# Altium project projectmotherboad1.PrjPcb
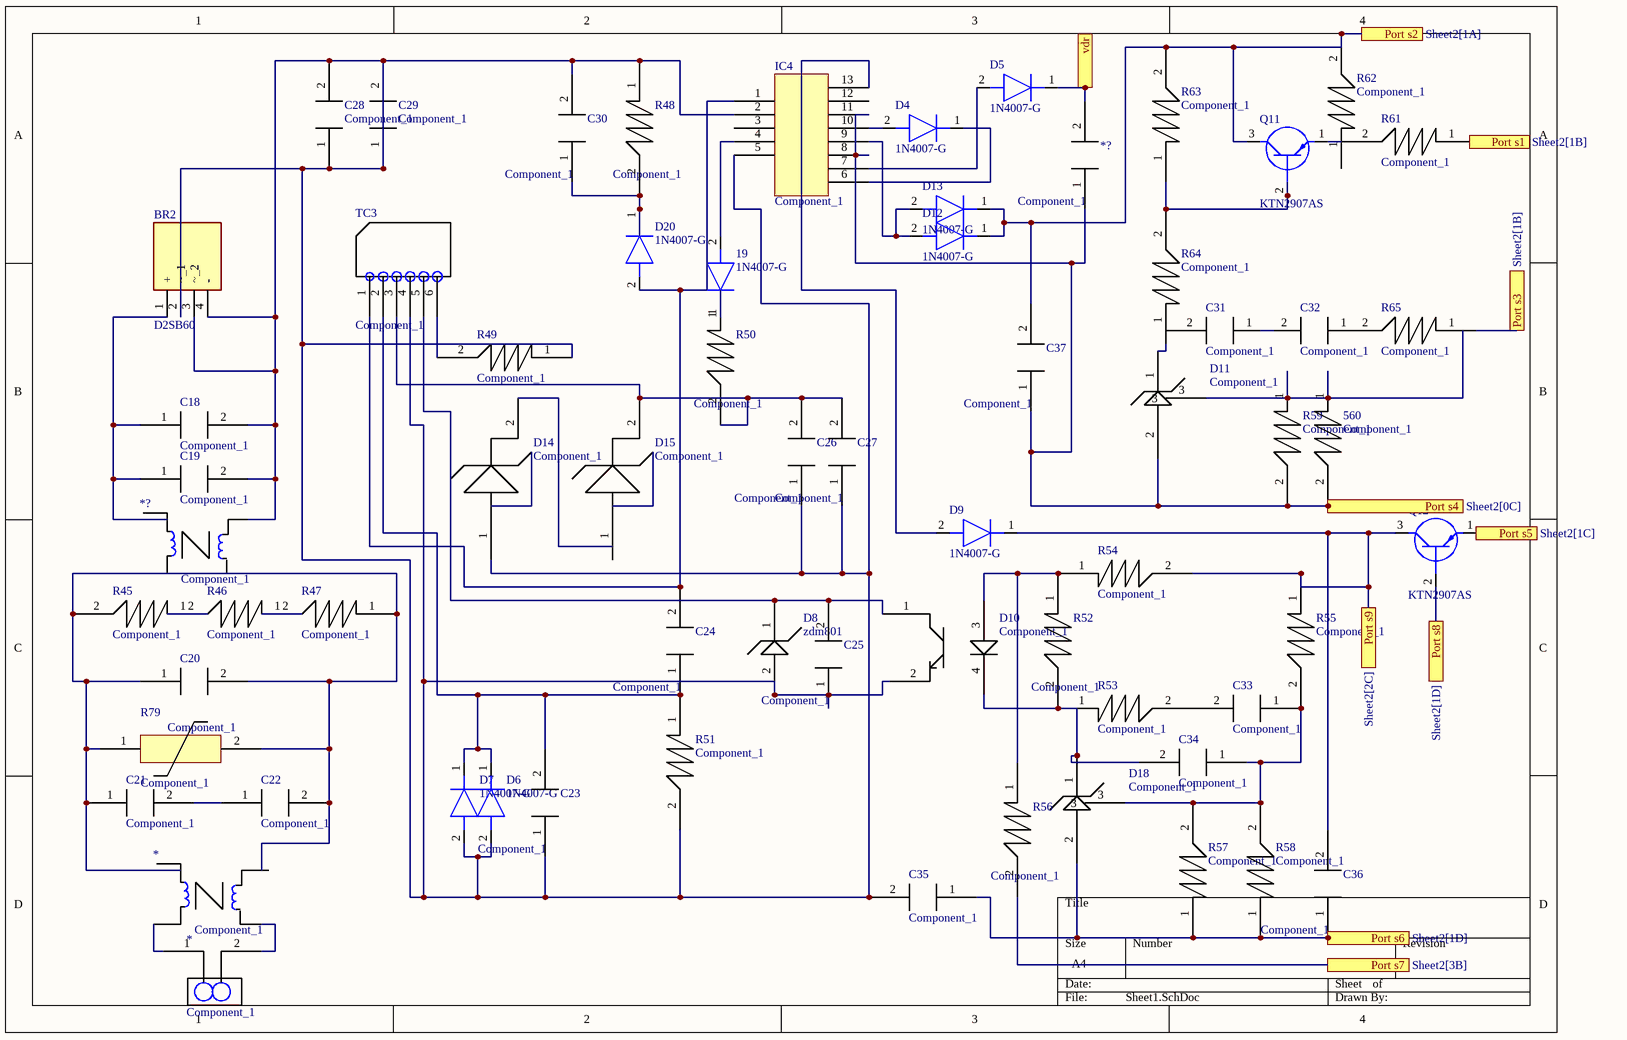
[diagram p0: Sheet1.SchDoc]
2 sheets, 92 parts. Net scope: flat (ports and power ports of the same name join across sheets).
Sheets:
  Sheet1.SchDoc
  Sheet2.SchDoc

## Sheet Sheet1.SchDoc
size A4; SheetNumber: 1; SheetTotal: 2

### Parts
(Parts that share a designator on the sheet are numbered #1, #2 ... from top to bottom, then left to right.)
19  1N4007-G  [DIOAD1410W90L470D235]
560  Component_1  [PCBComponent_1]
*#1  Component_1  [PCBComponent_1]
*#2  Component_1  [PCBComponent_1]
*?#1  Component_1  [PCBComponent_1]
*?#2  Component_1  [PCBComponent_1]
BR2  D2SB60  [D2SB60]
C18  Component_1  [PCBComponent_1]
C19  Component_1  [PCBComponent_1]
C20  Component_1  [PCBComponent_1]
C21  Component_1  [PCBComponent_1]
C22  Component_1  [PCBComponent_1]
C23  Component_1  [PCBComponent_1]
C24  Component_1  [PCBComponent_1]
C25  Component_1  [PCBComponent_1]
C26  Component_1  [PCBComponent_1]
C27  Component_1  [PCBComponent_1]
C28  Component_1  [PCBComponent_1]
C29  Component_1  [PCBComponent_1]
C30  Component_1  [PCBComponent_1]
C31  Component_1  [PCBComponent_1]
C32  Component_1  [PCBComponent_1]
C33  Component_1  [PCBComponent_1]
C34  Component_1  [PCBComponent_1]
C35  Component_1  [PCBComponent_1]
C36  Component_1  [PCBComponent_1]
C37  Component_1  [PCBComponent_1]
D4  1N4007-G  [DIOAD1410W90L470D235]
D5  1N4007-G  [DIOAD1410W90L470D235]
D6  1N4007-G  [DIOAD1410W90L470D235]
D7  1N4007-G  [DIOAD1410W90L470D235]
D8  zdm801  [PCBComponent_1]
D9  1N4007-G  [DIOAD1410W90L470D235]
D10  Component_1  [PCBComponent_1]
D11  Component_1  [PCBComponent_1]
D12  1N4007-G  [DIOAD1410W90L470D235]
D13  1N4007-G  [DIOAD1410W90L470D235]
D14  Component_1
D15  Component_1
D18#1  Component_1  [PCBComponent_1]
D20  1N4007-G  [DIOAD1410W90L470D235]
IC4  Component_1  [PCBComponent_1]
Q11  KTN2907AS  [SOT95P245X130-3N]
Q12  KTN2907AS  [SOT95P245X130-3N]
R45  Component_1  [PCBComponent_1]
R46  Component_1  [PCBComponent_1]
R47  Component_1  [PCBComponent_1]
R48  Component_1  [PCBComponent_1]
R49  Component_1  [PCBComponent_1]
R50  Component_1  [PCBComponent_1]
R51  Component_1  [PCBComponent_1]
R52  Component_1  [PCBComponent_1]
R53  Component_1  [PCBComponent_1]
R54  Component_1  [PCBComponent_1]
R55  Component_1  [PCBComponent_1]
R56  Component_1  [PCBComponent_1]
R57  Component_1  [PCBComponent_1]
R58  Component_1  [PCBComponent_1]
R59  Component_1  [PCBComponent_1]
R61  Component_1  [PCBComponent_1]
R62  Component_1  [PCBComponent_1]
R63  Component_1  [PCBComponent_1]
R64  Component_1  [PCBComponent_1]
R65  Component_1  [PCBComponent_1]
R79  Component_1
TC3  Component_1  [PCBComponent_1]

### Ports
Port s1 (see Sheet2[1B]), Port s2 (see Sheet2[1A]), Port s3 (see Sheet2[1B]), Port s4 (see Sheet2[0C]), Port s5 (see Sheet2[1C]), Port s6 (see Sheet2[1D]), Port s7 (see Sheet2[3B]), Port s8 (see Sheet2[1D]), Port s9 (see Sheet2[2C]), vdr

### Nets
Net19_1: 19.1(K) R50.1
Net19_2: 19.2(A) IC4.4
Net560_1: 560.1 D11.3 R59.1
Net560_2: 560.2 *?#1.1 C35.1 C36.1 C36.2 C37.1 D9.1(K) D11.2 D18#1.2 IC4.8 IC4.11 Q12.3(C) R54.2 R55.1 R57.1 R58.1 R59.2 ; port Port s4, port Port s6, port Port s9
Net*?#1_2: *?#1.2 D5.1(K) ; port vdr
Net*?#3_1: R65.1 ; port Port s3
NetBR2_1: BR2.1(+) C18.1 C19.1
NetBR2_2: BR2.2(~_1) BR2.3(~_2) BR2.4(-) C18.2 C19.2 C23.1 C25.1 C26.1 C27.1 C28.1 C28.2 C29.1 C29.2 C30.2 C35.2 D6.2(A) D7.2(A) D8.2 D10.2 D14.1 IC4.2 IC4.5 R48.1 R49.1 R51.2 TC3.4
NetC20_1: C20.1 C20.2 C21.1 C22.2 R45.2 R47.1 R79.1 R79.2
NetC21_2: C21.2 C22.1
NetC23_2: C23.2 C24.1 D6.1(K) D7.1(K) R51.1 TC3.2
NetC24_2: C24.2 D20.2(A) IC4.1 TC3.1
NetC25_2: C25.2 D8.1 D10.1 TC3.5
NetC26_2: C26.2 C27.2 D15.2 R50.2 TC3.3
NetC30_1: C30.1 D20.1(K) R48.2
NetC31_1: C31.1 C32.2
NetC33_1: C33.1 C34.1 D18#1.3 R55.2 R57.2 R58.2
NetC33_2: C33.2 R53.2
NetC34_2: C34.2 D10.4 D18#1.1 R52.2 R53.1
NetC37_2: C37.2 D12.1(K) D13.1(K) Q11.3(C) R62.2 R63.2 ; port Port s2
NetC40_2: Q12.1(E) ; port Port s5
NetD4_1: D4.1(K) IC4.6
NetD4_2: D4.2(A) IC4.10
NetD5_2: D5.2(A) IC4.7
NetD9_2: D9.2(A) IC4.13
NetD10_3: D10.3 R52.1 R54.1 R56.1
NetD11_1: D11.1 R64.1
NetD12_2: D12.2(A) D13.2(A) IC4.9
NetD18#2_2: Q12.2(B) ; port Port s8
NetQ11_1: Q11.1(E) R61.2
NetQ11_2: Q11.2(B) R63.1 R64.2
NetQ15_1: R56.2 ; port Port s7
NetR45_1: R45.1 R46.2
NetR46_1: R46.1 R47.2
NetR49_2: R49.2 TC3.6

Not connected (* = marked no-connect by the designer): *#1 1 2; C31 2; C32 1; D14 2; D15 1; IC4 3 12; R61 1; R62 1; R65 2

### Library data of the parts
19 D4-D7 D9 D12 D13 D20 = 1N4007-G: Diode; Manufacturer_Name: Comchip Technology; Datasheet Link: https://datasheet.datasheetarchive.com/originals/distributors/Datasheets-DGA23/1390217.pdf; Manufacturer_Part_Number: 1N4007-G; Mouser Part Number: 750-1N4007-G; Mouser Price/Stock: https://www.mouser.co.uk/ProductDetail/Comchip-Technology/1N4007-G?qs=2qJf6qQ4IOKzApuByvlhjQ%3D%3D; Arrow Part Number: 1N4007-G; Arrow Price/Stock: https://www.arrow.com/en/products/1n4007-g/comchip-technology?region=nac
BR2 = D2SB60: Bridge Rectifier; Manufacturer_Name: Taiwan Semiconductor; Datasheet Link: https://www.taiwansemi.com/assets/uploads/datasheet/D2SB05%20SERIES_K2103.pdf; Height: 11.3mm; Manufacturer_Part_Number: D2SB60; Mouser Part Number: 821-D2SB60; Mouser Price/Stock: https://www.mouser.com/Search/Refine.aspx?Keyword=821-D2SB60
Q11 Q12 = KTN2907AS: Transistor BJT PNP; Manufacturer_Name: KEC; Datasheet Link: https://4donline.ihs.com/images/VipMasterIC/IC/KECC/KECC-S-A0011628695/KECC-S-A0011628695-1.pdf?hkey=EF798316E3902B6ED9A73243A3159BB0; Height: 1.3mm; Manufacturer_Part_Number: KTN2907AS

## Sheet Sheet2.SchDoc
size A4; SheetNumber: 2; SheetTotal: 2
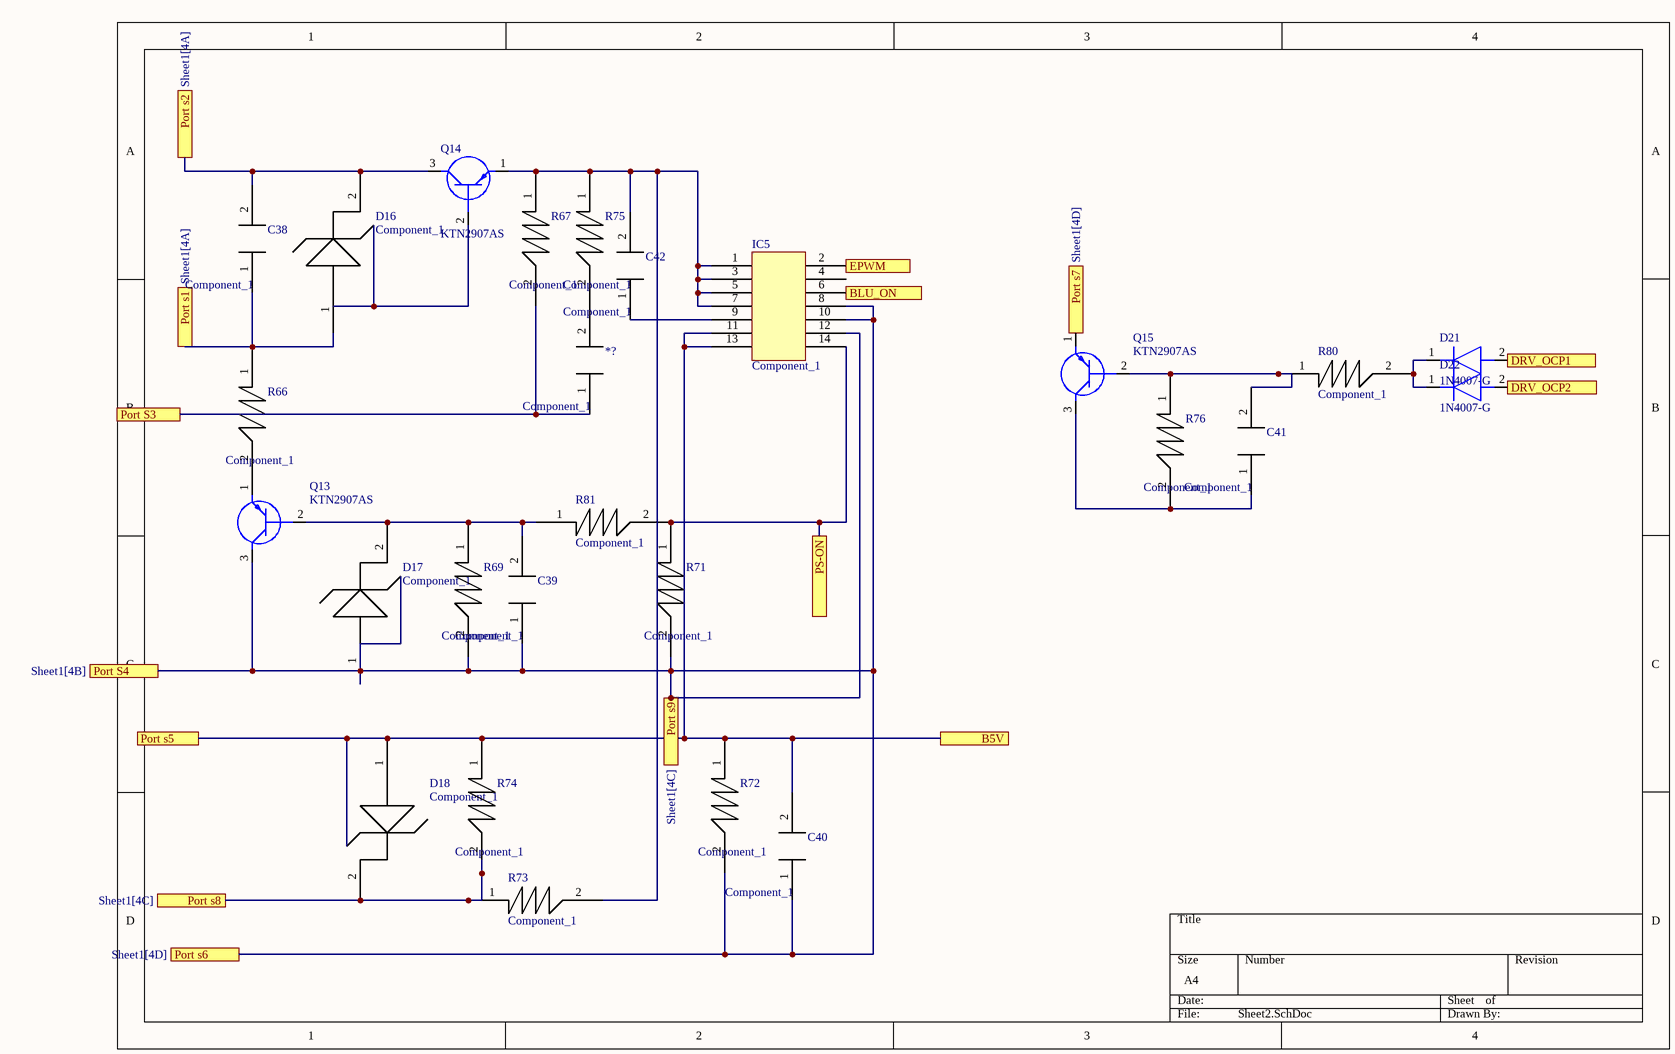
[diagram p1: Sheet2.SchDoc]

### Parts
(Parts that share a designator on the sheet are numbered #1, #2 ... from top to bottom, then left to right.)
*?#3  Component_1  [PCBComponent_1]
C38  Component_1  [PCBComponent_1]
C39  Component_1  [PCBComponent_1]
C40  Component_1  [PCBComponent_1]
C41  Component_1  [PCBComponent_1]
C42  Component_1  [PCBComponent_1]
D16  Component_1
D17  Component_1
D18#2  Component_1
D21  1N4007-G  [DIOAD1410W90L470D235]
D22  1N4007-G  [DIOAD1410W90L470D235]
IC5  Component_1  [PCBComponent_1]
Q13  KTN2907AS  [SOT95P245X130-3N]
Q14  KTN2907AS  [SOT95P245X130-3N]
Q15  KTN2907AS  [SOT95P245X130-3N]
R66  Component_1  [PCBComponent_1]
R67  Component_1  [PCBComponent_1]
R69  Component_1  [PCBComponent_1]
R71  Component_1  [PCBComponent_1]
R72  Component_1  [PCBComponent_1]
R73  Component_1  [PCBComponent_1]
R74  Component_1  [PCBComponent_1]
R75  Component_1  [PCBComponent_1]
R76  Component_1  [PCBComponent_1]
R80  Component_1  [PCBComponent_1]
R81  Component_1  [PCBComponent_1]

### Ports
B5V, BLU_ON, DRV_OCP1, DRV_OCP2, EPWM, Port s1 (see Sheet1[4A]), Port s2 (see Sheet1[4A]), Port S3 (see Sheet1[4B]), Port S4 (see Sheet1[4B]), Port s5 (see Sheet1[4C]), Port s6 (see Sheet1[4D]), Port s7 (see Sheet1[4D]), Port s8 (see Sheet1[4C]), Port s9 (see Sheet1[4C]), PS-ON

### Nets
Net560_2: C39.1 C40.1 D17.1 IC5.8 IC5.10 IC5.12 Q13.3(C) R69.2 R71.2 R72.2 ; port Port S4, port Port s9, port Port s6
Net*?#3_1: *?#3.1 R67.2 ; port Port S3
Net*?#3_2: *?#3.2 R75.2
NetC37_2: C38.2 D16.2 Q14.3(C) ; port Port s2
NetC38_1: C38.1 D16.1 R66.1 ; port Port s1
NetC39_2: C39.2 D17.2 Q13.2(B) R69.1 R81.1
NetC40_2: C40.2 D18#2.1 IC5.11 IC5.13 R72.1 R74.1 ; port Port s5, port B5V
NetC41_1: C41.1 Q15.3(C) R76.2
NetC41_2: C41.2 Q15.2(B) R76.1 R80.1
NetC42_1: C42.1 IC5.9
NetC42_2: C42.2 IC5.1 IC5.3 IC5.5 IC5.7 Q14.1(E) R67.1 R73.2 R75.1
NetD18#2_2: D18#2.2 R73.1 R74.2 ; port Port s8
NetD21_1: D21.1(K) D22.1(K) R80.2
NetD21_2: D21.2(A) ; port DRV_OCP1
NetD22_2: D22.2(A) ; port DRV_OCP2
NetIC5_2: IC5.2 ; port EPWM
NetIC5_6: IC5.6 ; port BLU_ON
NetIC5_14: IC5.14 R71.1 R81.2 ; port PS-ON
NetQ13_1: Q13.1(E) R66.2
NetQ15_1: Q15.1(E) ; port Port s7

Not connected (* = marked no-connect by the designer): IC5 4; Q14 2(B)

### Library data of the parts
D21 D22 = 1N4007-G: as 19 on sheet Sheet1; Datasheet Link: https://datasheet.datasheetarchive.com/originals/distributors/Datasheets-DGA23/1390217.pdf; Manufacturer_Part_Number: 1N4007-G; Mouser Part Number: 750-1N4007-G; Mouser Price/Stock: https://www.mouser.co.uk/ProductDetail/Comchip-Technology/1N4007-G?qs=2qJf6qQ4IOKzApuByvlhjQ%3D%3D; Arrow Part Number: 1N4007-G; Arrow Price/Stock: https://www.arrow.com/en/products/1n4007-g/comchip-technology?region=nac
Q13-Q15 = KTN2907AS: as Q11 on sheet Sheet1; Datasheet Link: https://4donline.ihs.com/images/VipMasterIC/IC/KECC/KECC-S-A0011628695/KECC-S-A0011628695-1.pdf?hkey=EF798316E3902B6ED9A73243A3159BB0; Height: 1.3mm; Manufacturer_Part_Number: KTN2907AS

## Nets that join several sheets
Net560_2: Sheet1 (17 pins), Sheet2 (10 pins)
Net*?#3_1: Sheet1 (R65.1), Sheet2 (*?#3.1 R67.2)
NetC37_2: Sheet1 (6 pins), Sheet2 (C38.2 D16.2 Q14.3)
NetC40_2: Sheet1 (Q12.1), Sheet2 (6 pins)
NetD18#2_2: Sheet1 (Q12.2), Sheet2 (D18#2.2 R73.1 R74.2)
NetQ15_1: Sheet1 (R56.2), Sheet2 (Q15.1)